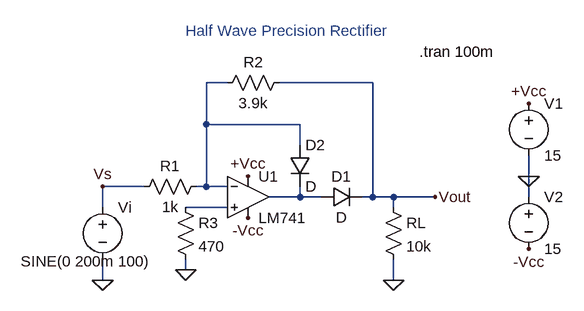
[diagram p0: schematic HWRect.asc]
HWRect.asc, the LTspice schematic file:
Version 4
SHEET 1 880 680
WIRE 176 -32 144 -32
WIRE 400 -32 256 -32
WIRE 144 32 144 -32
WIRE 288 32 144 32
WIRE 288 64 288 32
WIRE 640 112 640 80
WIRE 48 128 -16 128
WIRE 144 128 144 32
WIRE 144 128 128 128
WIRE 176 128 144 128
WIRE 288 144 288 128
WIRE 288 144 240 144
WIRE 320 144 288 144
WIRE 400 144 400 -32
WIRE 400 144 384 144
WIRE 432 144 400 144
WIRE 496 144 432 144
WIRE 640 144 640 112
WIRE -16 160 -16 128
WIRE 176 160 112 160
WIRE 432 160 432 144
WIRE 112 256 112 240
WIRE -16 272 -16 240
WIRE 432 272 432 240
FLAG 112 256 0
FLAG -16 272 0
FLAG 432 272 0
FLAG 496 144 Vout
FLAG 640 112 0
FLAG 640 0 +Vcc
FLAG 208 112 +Vcc
FLAG 640 224 -Vcc
FLAG 208 176 -Vcc
FLAG -16 128 Vs
SYMBOL Opamps\\LM741 208 80 R0
SYMATTR InstName U1
SYMBOL res 144 112 R90
WINDOW 0 0 56 VBottom 2
WINDOW 3 32 56 VTop 2
SYMATTR InstName R1
SYMATTR Value 1k
SYMBOL diode 320 160 R270
WINDOW 0 32 32 VTop 2
WINDOW 3 0 32 VBottom 2
SYMATTR InstName D1
SYMBOL diode 272 64 R0
SYMATTR InstName D2
SYMBOL res 272 -48 R90
WINDOW 0 0 56 VBottom 2
WINDOW 3 32 56 VTop 2
SYMATTR InstName R2
SYMATTR Value 3.9k
SYMBOL res 96 144 R0
SYMATTR InstName R3
SYMATTR Value 470
SYMBOL voltage -16 144 R0
WINDOW 3 -126 99 Left 2
WINDOW 39 0 0 Left 2
SYMATTR Value SINE(0 200m 100)
SYMATTR InstName Vi
SYMATTR Value2 AC 50m 0
SYMBOL res 416 144 R0
SYMATTR InstName RL
SYMATTR Value 10k
SYMBOL voltage 640 128 R0
SYMATTR InstName V2
SYMATTR Value 15
SYMBOL voltage 640 -16 R0
SYMATTR InstName V1
SYMATTR Value 15
TEXT 472 -80 Left 2 !.tran 100m
TEXT 112 -112 Left 2 ;Half Wave Precision Rectifier

The netlist it stands for:
* HWRect.asc
XU1 N003 N001 +Vcc -Vcc N002 LM741  ; pins In+ In- V+ V- OUT
R1 N001 Vs 1k
D1 N002 Vout D
D2 N001 N002 D
R2 Vout N001 3.9k
R3 N003 0 470
Vi Vs 0 SINE(0 200m 100) AC 50m 0
RL Vout 0 10k
V2 0 -Vcc 15
V1 +Vcc 0 15
.model D D
.lib standard.dio
.tran 100m
* Half Wave Precision Rectifier
.lib LM741.lib
.backanno
.end